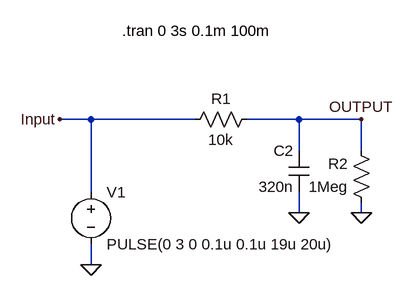
[diagram p0: schematic Low_Pass_Filter.asc]
Low_Pass_Filter.asc, the LTspice schematic file:
Version 4
SHEET 1 880 680
WIRE -32 128 -80 128
WIRE 128 128 -32 128
WIRE 288 128 208 128
WIRE 384 128 288 128
WIRE 288 176 288 128
WIRE 384 176 384 128
WIRE -32 240 -32 128
WIRE 288 272 288 240
WIRE 384 272 384 256
WIRE -32 352 -32 320
FLAG 288 272 0
FLAG 384 272 0
FLAG -80 128 Input
FLAG 384 128 OUTPUT
FLAG -32 352 0
SYMBOL res 224 112 R90
WINDOW 0 0 56 VBottom 0
WINDOW 3 32 56 VTop 0
SYMATTR InstName R1
SYMATTR Value 10k
SYMBOL res 400 272 R180
WINDOW 0 36 76 Left 0
WINDOW 3 36 40 Left 0
SYMATTR InstName R2
SYMATTR Value 1Meg
SYMBOL cap 304 240 R180
WINDOW 0 24 64 Left 0
WINDOW 3 24 8 Left 0
SYMATTR InstName C2
SYMATTR Value 320n
SYMBOL voltage -32 224 R0
WINDOW 123 0 0 Left 0
WINDOW 39 0 0 Left 0
SYMATTR InstName V1
SYMATTR Value PULSE(0 3 0 0.1u 0.1u 19u 20u)
TEXT 16 -8 Left 0 !.tran 0 3s 0.1m 100m

The netlist it stands for:
* Low_Pass_Filter.asc
R1 OUTPUT Input 10k
R2 0 OUTPUT 1Meg
C2 0 OUTPUT 320n
V1 Input 0 PULSE(0 3 0 0.1u 0.1u 19u 20u)
.tran 0 3s 0.1m 100m
.backanno
.end